# EAGLE schematic schematic (EAGLE 9.2.2)
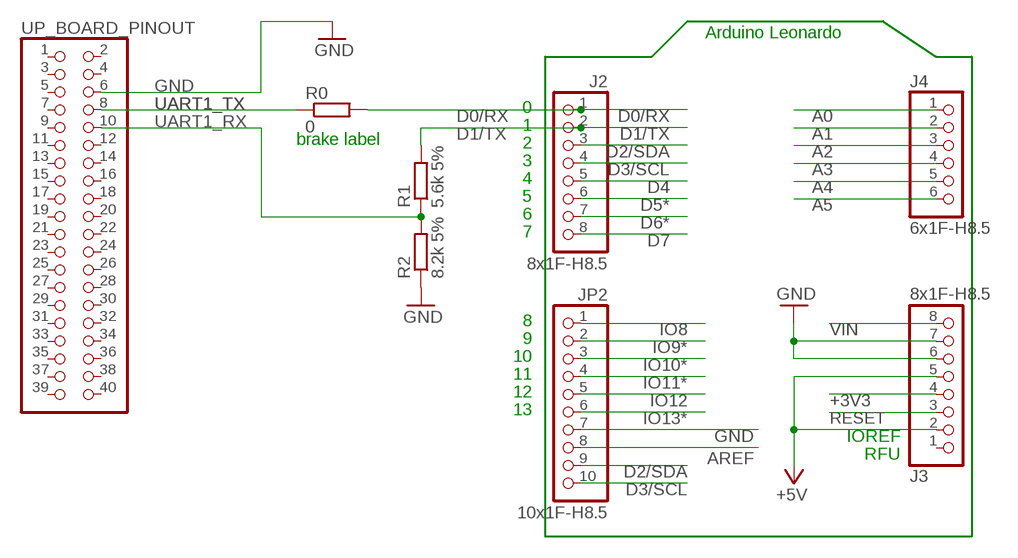
[diagram p0: schematic, sheet 1]

## Parts
J2  8x1F-H8.5  PINHD-1X8  [1X08]
J3  8x1F-H8.5  PINHD-1X8  [1X08]
J4  6x1F-H8.5  PINHD-1X6  [1X06]
JP2  10x1F-H8.5  PINHD-1X10  [1X10]
R0  0  R-EU_0204/2V  [0204V]
R1  5.6k 5%  R-EU_0204/2V  [0204V]
R2  8.2k 5%  R-EU_0204/2V  [0204V]
UP_BOARD_PINOUT  PINHD-2X20  [2X20]

## Nets
+3V3: J3.4
+5V [usbvcc]: J3.2 J3.5
A0: J4.1
A1: J4.2
A2: J4.3
A3: J4.4
A4: J4.5
A5: J4.6
AREF [aref]: JP2.8
D0/RX: J2.1 R0.2
D1/TX: J2.2 R1.2
D2/SDA: J2.3 JP2.9
D3/SCL: J2.4 JP2.10
D4: J2.5
D5*: J2.6
D6*: J2.7
D7: J2.8
GND: J3.6 J3.7 JP2.7 R2.1 UP_BOARD_PINOUT.6
IO8: JP2.1
IO9*: JP2.2
IO10*: JP2.3
IO11*: JP2.4
IO12: JP2.5
IO13*: JP2.6
RESET: J3.3
UART1_RX: R1.1 R2.2 UP_BOARD_PINOUT.10
UART1_TX: R0.1 UP_BOARD_PINOUT.8
VIN [power]: J3.8
Unconnected: J3.1 UP_BOARD_PINOUT.1 UP_BOARD_PINOUT.2 UP_BOARD_PINOUT.3 UP_BOARD_PINOUT.4 UP_BOARD_PINOUT.5 UP_BOARD_PINOUT.7 UP_BOARD_PINOUT.9 UP_BOARD_PINOUT.11 UP_BOARD_PINOUT.12 UP_BOARD_PINOUT.13 UP_BOARD_PINOUT.14 UP_BOARD_PINOUT.15 UP_BOARD_PINOUT.16 UP_BOARD_PINOUT.17 UP_BOARD_PINOUT.18 UP_BOARD_PINOUT.19 UP_BOARD_PINOUT.20 UP_BOARD_PINOUT.21 UP_BOARD_PINOUT.22 UP_BOARD_PINOUT.23 UP_BOARD_PINOUT.24 UP_BOARD_PINOUT.25 UP_BOARD_PINOUT.26 UP_BOARD_PINOUT.27 UP_BOARD_PINOUT.28 UP_BOARD_PINOUT.29 UP_BOARD_PINOUT.30 UP_BOARD_PINOUT.31 UP_BOARD_PINOUT.32 UP_BOARD_PINOUT.33 UP_BOARD_PINOUT.34 UP_BOARD_PINOUT.35 UP_BOARD_PINOUT.36 UP_BOARD_PINOUT.37 UP_BOARD_PINOUT.38 UP_BOARD_PINOUT.39 UP_BOARD_PINOUT.40

## Notes on the sheet
- Arduino Leonardo
- 0
- 1
- 2
- brake label
- 3
- 4
- 5
- 6
- 7
- 8
- 9
- 10
- 11
- 12
- 13
- IOREF
- RFU

## Library data of the parts
J2 J3 = SmartPrj:PINHD-1X8: PIN HEADER
J4 = SmartPrj:PINHD-1X6: PIN HEADER
JP2 = SmartPrj:PINHD-1X10: PIN HEADER
R0 R1 R2 = rcl:R-EU_: RESISTOR, European symbol; SPICEPREFIX: R
UP_BOARD_PINOUT = pinhead:PINHD-2X20: PIN HEADER

## Net classes
1 power: width 0.254 mm, drill 0.499 mm, clearance 0.254 mm
2 gnd: width 0.254 mm, drill 0.499 mm, clearance 0.254 mm
3 usbvcc: width 0.254 mm, drill 0.499 mm, clearance 0.254 mm
4 aref: width 0.254 mm, drill 0.499 mm, clearance 0.254 mm